# Altium schematic sheet TDII_TFT_R00.SchDoc
size A4
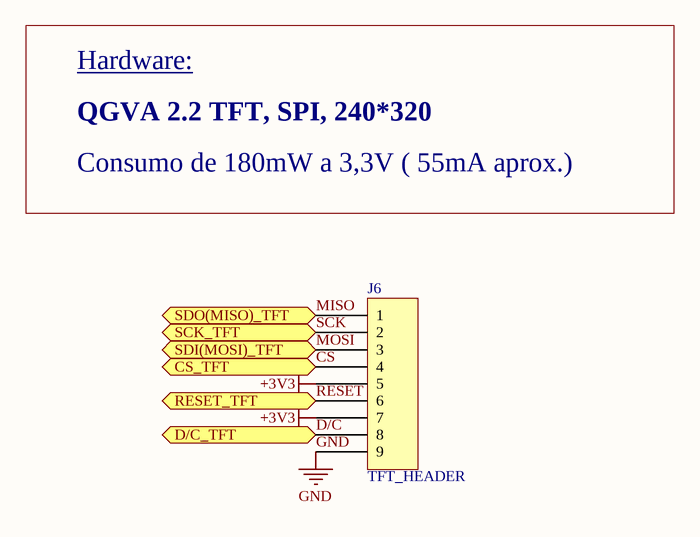
[diagram p0: TDII_TFT_R00.SchDoc]

## Parts
J6  TFT_HEADER  [Conector_TFT]

## Ports
CS_TFT (in), D/C_TFT (in), RESET_TFT (in), SCK_TFT (in), SDI(MOSI)_TFT (in), SDO(MISO)_TFT (out)

## Nets
+3V3: J6.5 J6.7
GND: J6.9
CS: J6.4 ; port CS_TFT
D/C: J6.8 ; port D/C_TFT
MISO: J6.1 ; port SDO(MISO)_TFT
MOSI: J6.3 ; port SDI(MOSI)_TFT
RESET: J6.6 ; port RESET_TFT
SCK: J6.2 ; port SCK_TFT

## Notes on the sheet
- Hardware:
- QGVA 2.2 TFT, SPI, 240*320
- Consumo de 180mW a 3,3V ( 55mA aprox.)

## Library data of the parts
J6 = Conector_9 (0.100¨)